# Altium schematic sheet STM32.SchDoc
size Letter
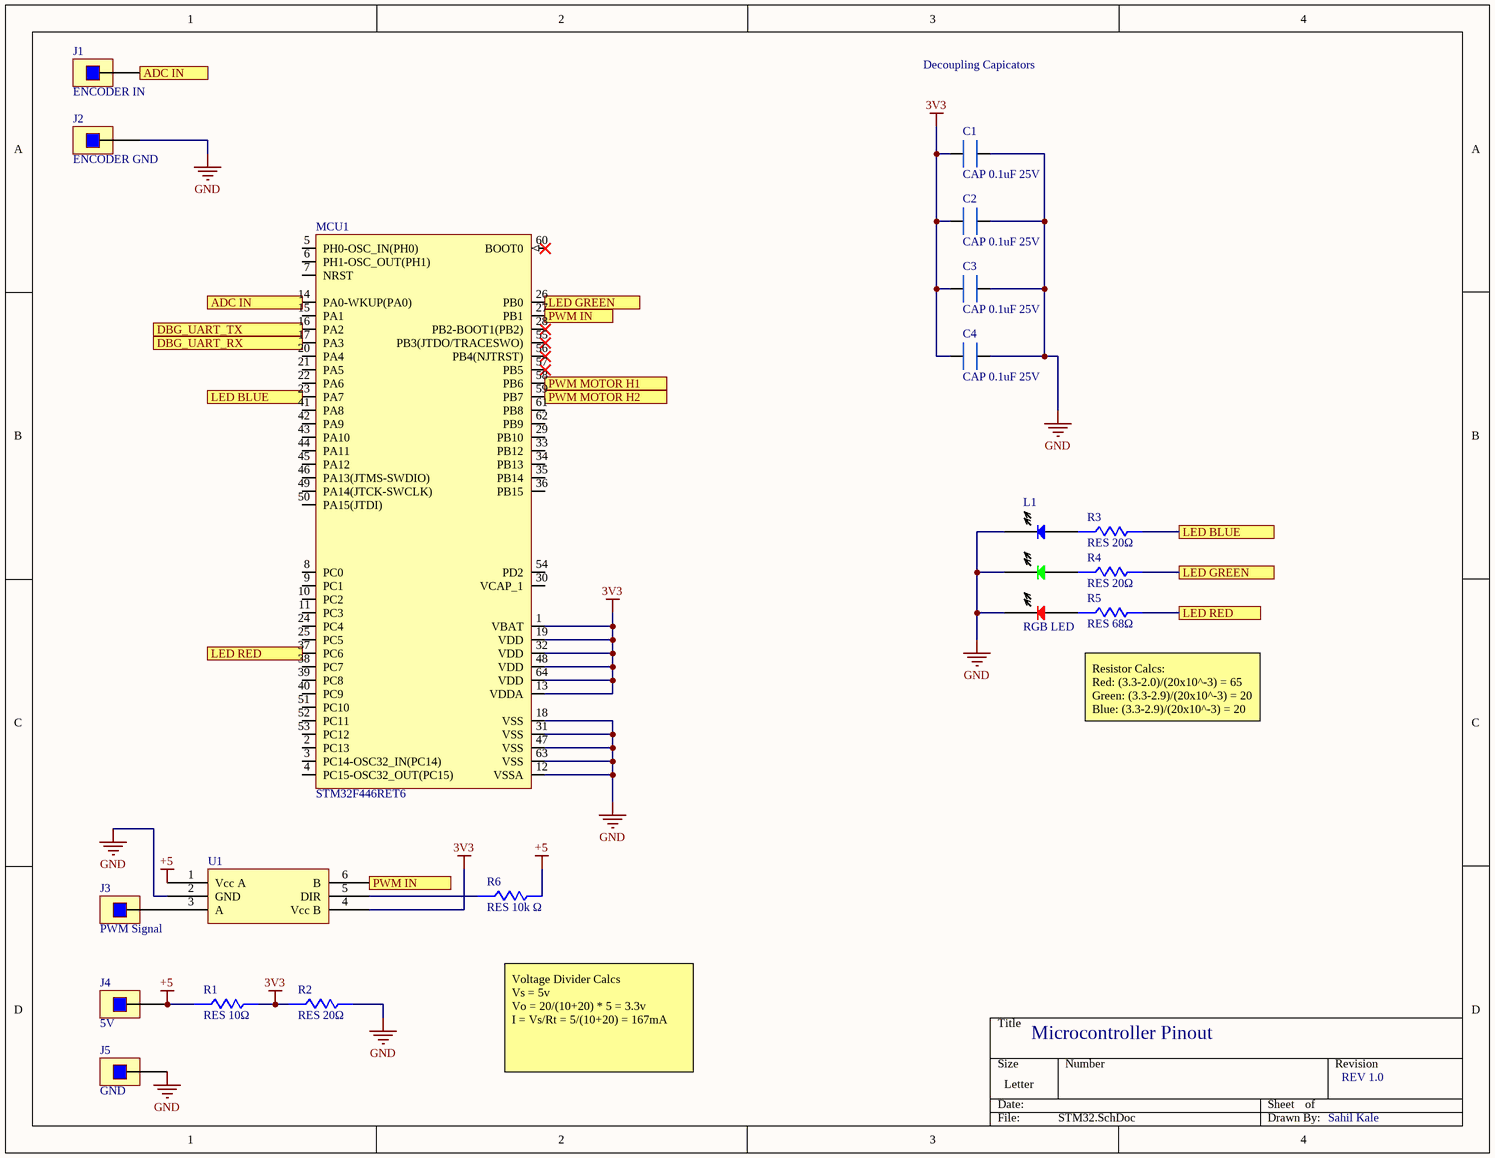
[diagram p0: STM32.SchDoc]

## Parts
C1  CAP 0.1uF 25V
C2  CAP 0.1uF 25V
C3  CAP 0.1uF 25V
C4  CAP 0.1uF 25V
J1  ENCODER IN  [PIN_HEADER]
J2  ENCODER GND  [PIN_HEADER]
J3  PWM Signal  [PIN_HEADER]
J4  5V  [PIN_HEADER]
J5  GND  [PIN_HEADER]
L1  RGB LED  [UHD1110-FKA-CL1A13R3Q1BBQFMF3]
MCU1  STM32F446RET6
R1  RES 10Ω  [RE0603FRE0710RL]
R2  RES 20Ω  [SDR03EZPJ200]
R3  RES 20Ω  [SDR03EZPJ200]
R4  RES 20Ω  [SDR03EZPJ200]
R5  RES 68Ω
R6  RES 10k Ω
U1  74LVC1T45Z6-7  (value not drawn)

## Ports
ADC IN, DBG_UART_RX, DBG_UART_TX, LED BLUE, LED GREEN, LED RED, PWM IN, PWM MOTOR H1, PWM MOTOR H2

## Nets
3V3: C1.0 C2.0 C3.0 C4.0 MCU1.1(VBAT) MCU1.13(VDDA) MCU1.19(VDD) MCU1.32(VDD) MCU1.48(VDD) MCU1.64(VDD) R1.1 R2.2 U1.4(Vcc_B)
+5: J4.1 R1.2 R6.1 U1.1(Vcc_A)
GND: C1.1 C2.1 C3.1 C4.1 J2.1 J5.1 L1.1(GREEN_-) L1.3(RED_-) L1.5(BLUE_-) MCU1.12(VSSA) MCU1.18(VSS) MCU1.31(VSS) MCU1.47(VSS) MCU1.63(VSS) R2.1 U1.2(GND)
ADC IN: J1.1 MCU1.14(PA0-WKUP(PA0)) ; port ADC IN
DBG_UART_RX: MCU1.17(PA3) ; port DBG_UART_RX
DBG_UART_TX: MCU1.16(PA2) ; port DBG_UART_TX
LED BLUE: MCU1.23(PA7) R3.1 ; port LED BLUE
LED GREEN: MCU1.26(PB0) R4.1 ; port LED GREEN
LED RED: MCU1.37(PC6) R5.1 ; port LED RED
PWM IN: MCU1.27(PB1) U1.6(B) ; port PWM IN
PWM MOTOR H1: MCU1.58(PB6) ; port PWM MOTOR H1
PWM MOTOR H2: MCU1.59(PB7) ; port PWM MOTOR H2
NetJ3_1: J3.1 U1.3(A)
NetL1_2: L1.2(Green_+) R4.2
NetL1_4: L1.4(Red_+) R5.2
NetL1_6: L1.6(Blue_+) R3.2
NetR6_2: R6.2 U1.5(DIR)

Not connected (* = marked no-connect by the designer): MCU1 2(PC13) 3(PC14-OSC32_IN(PC14)) 4(PC15-OSC32_OUT(PC15)) 5(PH0-OSC_IN(PH0)) 6(PH1-OSC_OUT(PH1)) 7(NRST) 8(PC0) 9(PC1) 10(PC2) 11(PC3) 15(PA1) 20(PA4) 21(PA5) 22(PA6) 24(PC4) 25(PC5) 28(PB2-BOOT1(PB2))* 29(PB10) 30(VCAP_1) 33(PB12) 34(PB13) 35(PB14) 36(PB15) 38(PC7) 39(PC8) 40(PC9) 41(PA8) 42(PA9) 43(PA10) 44(PA11) 45(PA12) 46(PA13(JTMS-SWDIO)) 49(PA14(JTCK-SWCLK)) 50(PA15(JTDI)) 51(PC10) 52(PC11) 53(PC12) 54(PD2) 55(PB3(JTDO/TRACESWO))* 56(PB4(NJTRST))* 57(PB5)* 60(BOOT0)* 61(PB8) 62(PB9)

## Notes on the sheet
- Decoupling Capicators
- Resistor Calcs:
  Red: (3.3-2.0)/(20x10^-3) = 65
  Green: (3.3-2.9)/(20x10^-3) = 20
  Blue: (3.3-2.9)/(20x10^-3) = 20
- Microcontroller Pinout
- Voltage Divider Calcs
  Vs = 5v
  Vo = 20/(10+20) * 5 = 3.3v
  I = Vs/Rt = 5/(10+20) = 167mA
- REV 1.0
- Sahil Kale

## Library data of the parts
C1-C4 = CAP 0.1uF 25V: Tantalum Capacitor, Polarized, Tantalum (dry/solid), 25V, 20% +Tol, 20% -Tol, 0.1uF, Surface Mount, 0805; Manufacturer: Vishay; Manufacturer Part Number: TMCP1E104MTRF; Supplier 1: Digi-Key; RoHS: No; Category: Tantalum Capacitors; Stock 1: 2857; Pricing 1: 1=0.33000, 10=0.22600, 50=0.15800, 100=0.13550, 500=0.10158, 1000=0.08579 (USD); Number of Pins: 2; Dielectric Material: Tantalum; Terminal Finish: Tin; JESD-609 Code: e3; Capacitor Type: Tantalum; ComponentLink1URL: https://datasheet.ciiva.com:443/pdfs/VipMasterIC/IC/VISH/VISH-S-A0002931701/VISH-S-A0002931701-1.pdf?src-supplier=IHS+Markit; ComponentLink1Description: https://datasheet.ciiva.com:443/pdfs/VipMasterIC/IC/VISH/VISH-S-A0002931701/VISH-S-A0002931701-1.pdf?src-supplier=IHS+Markit; Supplier Part Number 1: 718-2505-1-ND
J1-J5 = PIN_HEADER: Board Connector, 1 Contact(s), 1 Row(s), Male, Straight, Solder Terminal; Manufacturer: Sullins; Manufacturer Part Number: PREC001SAAN-RC; Option: General Purpose; Filter Feature: No; Number of Rows Loaded: 1; Supplier 1: Digi-Key; RoHS: Yes; Category: Connectors; Stock 1: 16681; Pricing 1: 1=0.04000, 10=0.03000, 25=0.02800, 50=0.02080, 100=0.01780, 250=0.01724, 500=0.01486 (USD); Mount: Board; Connector Type: BOARD CONNECTOR; Contact Gender: Male; Mixed Contacts: No; Mounting Style: STRAIGHT; Termination: Solder; Number of Contacts: 1; Flammability Rating: UL94 V-0; DIN Conformance: No; IEC Conformance: No; MIL Conformance: No; ComponentLink1URL: https://datasheet.ciiva.com:443/pdfs/VipMasterIC/IC/SUCS/SUCS-S-A0005121173/SUCS-S-A0005121173-1.pdf?src-supplier=IHS+Markit; ComponentLink1Description: https://datasheet.ciiva.com:443/pdfs/VipMasterIC/IC/SUCS/SUCS-S-A0005121173/SUCS-S-A0005121173-1.pdf?src-supplier=IHS+Markit; ComponentLink2URL: https://datasheet.ciiva.com/740/zrzczzzszzn-rc-st-11635-b-740844.pdf?src-supplier=Digi-Key; ComponentLink2Description: https://datasheet.ciiva.com/740/zrzczzzszzn-rc-st-11635-b-740844.pdf?src-supplier=Digi-Key; Supplier Part Number 1: S1012EC-01-ND
L1 = LED_RGB: Triple Color LED
R1 = RES 10Ω: Fixed Resistor, Metal Glaze/thick Film, 0.1W, 10ohm, 75V, 1% +/-Tol, 50ppm/Cel, Surface Mount, 0603; Manufacturer: Yageo; Rated Power Dissipation (P): 100mW; Rated Temperature: 70°C; Resistance: 10R; Temperature Coefficient: 50ppm/°C; Package Height: 0.45mm; Package Length: 1.6mm; Package Width: 0.8mm; Supplier 1: Digi-Key; Manufacturer Part Number: RE0603FRE0710RL; RoHS: Yes; Category: Chip SMD Resistors; Stock 1: 8567; Pricing 1: 1=0.10000, 10=0.05500, 100=0.02240, 1000=0.01007, 2500=0.00874 (USD); Mount: Surface Mount; Number of Pins: 2; Size Code: 0603; Terminal Finish: Nickel; Min Operating Temperature: -55°C; Max Operating Temperature: 155°C; Tolerance: 1%; JESD-609 Code: e3; Resistor Type: FIXED RESISTOR; Construction: Rectangular; Package Style: SMTMeter; Packaging: Tape and Reel; Technology: METAL GLAZE/THICK FILM; Termination: Wraparound; Working Voltage: 75V; ComponentLink1URL: https://datasheet.ciiva.com:443/pdfs/VipMasterIC/IC/YAGO/YAGO-S-A0003975721/YAGO-S-A0003975721-1.pdf?src-supplier=IHS+Markit; ComponentLink1Description: https://datasheet.ciiva.com:443/pdfs/VipMasterIC/IC/YAGO/YAGO-S-A0003975721/YAGO-S-A0003975721-1.pdf?src-supplier=IHS+Markit; ComponentLink2URL: http://www.yageo.com/NewPortal/yageodocoutput?fileName=/pdf/R-Chip/PYu-RE_105_RoHS_L_4.pdf&src-supplier=Digi-Key; ComponentLink2Description: http://www.yageo.com/NewPortal/yageodocoutput?fileName=/pdf/R-Chip/PYu-RE_105_RoHS_L_4.pdf&src-supplier=Digi-Key; Supplier Part Number 1: 13-RE0603FRE0710RLCT-ND
R2-R4 = RES 20Ω: Fixed Resistor, 0.1W, 20ohm, 50V, 5% +/-Tol, 200ppm/Cel, Surface Mount, 0603; Manufacturer: Rohm; Additional Feature: ANTI-SULFUR; Rated Power Dissipation (P): 100mW; Rated Temperature: 70°C; Resistance: 20R; Temperature Coefficient: 200ppm/°C; Reference Standard: TS 16949; Supplier 1: Digi-Key; Manufacturer Part Number: SDR03EZPJ200; RoHS: No; Category: Chip SMD Resistors; Stock 1: 3900; Pricing 1: 1=0.10000, 10=0.07300, 100=0.02800, 1000=0.01232, 2500=0.01064 (USD); Mount: Surface Mount; Number of Pins: 2; Package Shape: Rectangular; Size Code: 0603; Min Operating Temperature: -55°C; Max Operating Temperature: 155°C; Tolerance: 5%; Resistor Type: FIXED RESISTOR; Packaging: Tape and Reel; Termination: Wraparound; Working Voltage: 50V; ComponentLink1URL: https://datasheet.ciiva.com:443/pdfs/VipMasterIC/IC/ROHM/ROHM-S-A0002832543/ROHM-S-A0002832543-1.pdf?src-supplier=IHS+Markit; ComponentLink1Description: https://datasheet.ciiva.com:443/pdfs/VipMasterIC/IC/ROHM/ROHM-S-A0002832543/ROHM-S-A0002832543-1.pdf?src-supplier=IHS+Markit; ComponentLink2URL: https://www.rohm.com/datasheet/SDR03EZPJ/sdr-e?src-supplier=Digi-Key; ComponentLink2Description: https://www.rohm.com/datasheet/SDR03EZPJ/sdr-e?src-supplier=Digi-Key; Supplier Part Number 1: 511-1747-1-ND
R5 = RES 68Ω: VISCRCW120668R0JNEAC Res Thick Film 1206; Manufacturer: Vishay; Tolerance: 5%; Rated Power Dissipation (P): 250mW; Resistance: 68R; Temperature Coefficient: -200200ppm/°C; Working Voltage: 200V; Package Height: 0.55mm; Package Length: 3.05mm; Package Width: 1.55mm; Supplier 1: Digi-Key; Manufacturer Part Number: CRCW120668R0JNEAC; Stock 1: 24990; Pricing 1: 1=0.10000, 10=0.06300, 100=0.02570, 1000=0.01153, 2500=0.01000 (USD); Number of Pins: 2; Size Code: 1206; Terminal Finish: Nickel; Min Operating Temperature: -55°C; Max Operating Temperature: 155°C; JESD-609 Code: e3; Resistor Type: FIXED RESISTOR; Construction: Chip; Package Style: SMTMeter; Packaging: Tape and Reel; Technology: METAL GLAZE/THICK FILM; ComponentLink1URL: https://datasheet.ciiva.com:443/pdfs/VipMasterIC/IC/VISH/VISH-S-A0003599164/VISH-S-A0003599164-1.pdf?src-supplier=IHS+Markit; ComponentLink1Description: https://datasheet.ciiva.com:443/pdfs/VipMasterIC/IC/VISH/VISH-S-A0003599164/VISH-S-A0003599164-1.pdf?src-supplier=IHS+Markit; Supplier Part Number 1: 541-CRCW120668R0JNEACCT-ND
R6 = RES 10k Ω: Fixed Resistor, Metal Glaze/thick Film, 0.25W, 10000ohm, 200V, 1% +/-Tol, 50ppm/Cel, Surface Mount, 1206; Manufacturer: Yageo; Manufacturer Part Number: RE1206FRE0710KL; Supplier 1: Digi-Key; RoHS: Yes; Category: Chip SMD Resistors; Stock 1: 6708; Pricing 1: 1=0.10000, 10=0.05900, 100=0.02390, 1000=0.01073, 2500=0.00932 (USD); ComponentLink1URL: https://datasheet.ciiva.com:443/pdfs/VipMasterIC/IC/YAGO/YAGO-S-A0003975721/YAGO-S-A0003975721-1.pdf?src-supplier=IHS+Markit; ComponentLink1Description: https://datasheet.ciiva.com:443/pdfs/VipMasterIC/IC/YAGO/YAGO-S-A0003975721/YAGO-S-A0003975721-1.pdf?src-supplier=IHS+Markit; ComponentLink2URL: http://www.yageo.com/NewPortal/yageodocoutput?fileName=/pdf/R-Chip/PYu-RE_105_RoHS_L_4.pdf&src-supplier=Digi-Key; ComponentLink2Description: http://www.yageo.com/NewPortal/yageodocoutput?fileName=/pdf/R-Chip/PYu-RE_105_RoHS_L_4.pdf&src-supplier=Digi-Key; Supplier Part Number 1: 13-RE1206FRE0710KLCT-ND
U1 = 74LVC1T45Z6-7: Bus Transceiver, LVC/LCX/Z Series, 1-Func, 1-Bit, True Output, CMOS, PDSO6; Manufacturer: Diodes; Package Body Material: Plastic; Control Type: COMMON CONTROL; Count Direction: Bidirectional; Load/Preset Input: Yes; Max I(ol): 24mA; Number of Bits: 1; Number of Ports: 2; Output Characteristics: 3-STATE; Power Supplies: 3.3V; Supply Voltage-Max (Vsup): 5.5V; Supply Voltage-Min (Vsup): 1.65V; Qualification Status: Not Qualified; Supplier 1: Digi-Key; Manufacturer Part Number: 74LVC1T45Z6-7; RoHS: Yes; Category: Logic ICs; Stock 1: 88129; Pricing 1: 1=0.39000, 10=0.29300, 25=0.26400, 100=0.18240, 250=0.15360, 500=0.12480, 1000=0.09600 (USD); Package Code: VSOF; Number of Pins: 6; Package Shape: Rectangular; Terminal Finish: Tin; Min Operating Temperature: -40°C; Max Operating Temperature: 125°C; JESD-609 Code: e3; Output Polarity: True; JESD-30 Code: R-PDSO-F6; Logic IC Type: BUS TRANSCEIVER; Moisture Sensitivity Level: 1; Number of Functions: 1; Package Style: SMALL OUTLINE, VERY THIN PROFILEMeter; Packaging: Tape and Reel; Supply Voltage-Nom (Vsup): 3.3V; Surface Mount: Yes; Technology: CMOS; Terminal Form: Flat; Terminal Position: DUAL; Width: 1.2mm; Height - Seated (Max): 0.6mm; Terminal Pitch: 0.5mm; Temperature Grade: AUTOMOTIVE; ComponentLink1URL: https://datasheet.ciiva.com:443/pdfs/VipMasterIC/IC/DIOD/DIOD-S-A0006644025/DIOD-S-A0006644025-1.pdf?src-supplier=IHS+Markit; ComponentLink1Description: https://datasheet.ciiva.com:443/pdfs/VipMasterIC/IC/DIOD/DIOD-S-A0006644025/DIOD-S-A0006644025-1.pdf?src-supplier=IHS+Markit; ComponentLink2URL: http://www.mouser.com/ds/2/115/74LVC1T45-318124.pdf?src-supplier=Mouser; ComponentLink2Description: http://www.mouser.com/ds/2/115/74LVC1T45-318124.pdf?src-supplier=Mouser; ComponentLink3URL: http://diodes.com/datasheets/74LVC1T45.pdf?src-supplier=Avnet; ComponentLink3Description: http://diodes.com/datasheets/74LVC1T45.pdf?src-supplier=Avnet; ComponentLink4URL: https://www.diodes.com/assets/Datasheets/74LVC1T45.pdf?src-supplier=Digi-Key; ComponentLink4Description: https://www.diodes.com/assets/Datasheets/74LVC1T45.pdf?src-supplier=Digi-Key; Supplier Part Number 1: 74LVC1T45Z6-7DICT-ND
MCU1 = STM32F446RET6: Parameter 1: *